# Altium schematic sheet 3V3-buck.SchDoc
size A; SheetNumber: 6; SheetTotal: 8
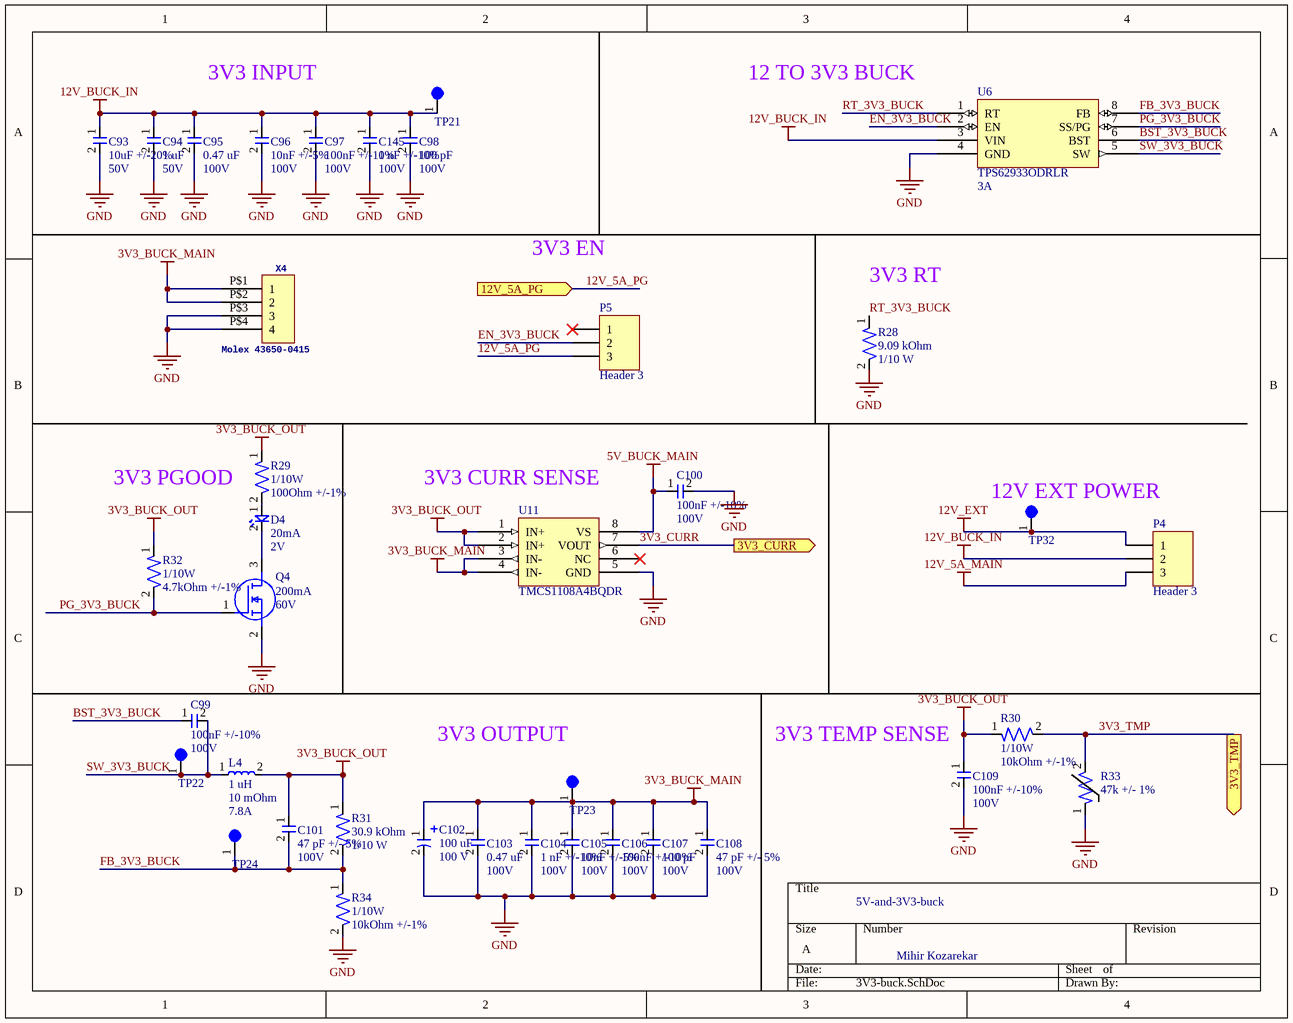
[diagram p0: 3V3-buck.SchDoc]

## Parts
C93  Capacitance: 10uF +/-20%  Voltage Rating: 50V  [CAP-1206]  (hidden comment: CL31B106KBHNNNE)
C94  Capacitance: 1 uF  Voltage: 50V  [CAP-0603]  (hidden comment: UMK107AB7105KA-T)
C95  Capacitance: 0.47 uF  Voltage: 100V  [CAP-0805]  (hidden comment: KAM21KR72A474KL)
C96  Capacitance: 10nF +/-5%  Voltage Rating: 100V  [CAP-0603]  (hidden comment: C1608C0G2A103J080AC)
C97  Capacitance: 100nF +/-10%  Voltage Rating: 100V  [CAP-0603]  (hidden comment: CC0603KRX7R0BB104)
C98  Capacitance: 100 pF  Voltage: 100V  [CAP-0603]  (hidden comment: 0603N101J101CT)
C99  Capacitance: 100nF +/-10%  Voltage Rating: 100V  [CAP-0603]  (hidden comment: CC0603KRX7R0BB104)
C100  Capacitance: 100nF +/-10%  Voltage Rating: 100V  [CAP-0603]  (hidden comment: CC0603KRX7R0BB104)
C101  Capacitance: 47 pF +/- 5%  Voltage Rating: 100V  [CAP-0603]  (hidden comment: 7447798111)
C102  Capacitance: 100 uF  Voltage: 100 V  [ELEC-100U-0001]  (hidden comment: 100SEV100M12.5X16)
C103  Capacitance: 0.47 uF  Voltage: 100V  [CAP-0805]  (hidden comment: KAM21KR72A474KL)
C104  Capacitance: 1 nF +/-10%  Voltage: 100V  [CAP-0603]  (hidden comment: C0603Y102K1RAC7867)
C105  Capacitance: 10nF +/-5%  Voltage Rating: 100V  [CAP-0603]  (hidden comment: C1608C0G2A103J080AC)
C106  Capacitance: 100nF +/-10%  Voltage Rating: 100V  [CAP-0603]  (hidden comment: CC0603KRX7R0BB104)
C107  Capacitance: 100 pF  Voltage: 100V  [CAP-0603]  (hidden comment: 0603N101J101CT)
C108  Capacitance: 47 pF +/- 5%  Voltage Rating: 100V  [CAP-0603]  (hidden comment: 7447798111)
C109  Capacitance: 100nF +/-10%  Voltage Rating: 100V  [CAP-0603]  (hidden comment: CC0603KRX7R0BB104)
C145  Capacitance: 1 nF +/-10%  Voltage: 100V  [CAP-0603]  (hidden comment: C0603Y102K1RAC7867)
D4  Current Rating: 20mA  Vf: 2V  [LED-0603]  (hidden comment: 150060AS75000)
L4  Inductance: 1 uH  DCR: 10 mOhm  DCI: 7.8A  [PWRIND-6.8U-0001]  (hidden comment: SRN8040-1R0Y)
P4  Header 3  [HDR1X3]
P5  Header 3  [HDR1X3]
Q4  Id-Continuous: 200mA  VDS-Max: 60V  [NMOS-SOT23-3]  (hidden comment: T2N7002AK,LM)
R28  Resistance: 9.09 kOhm  Power: 1/10 W  [RES-0603]  (hidden comment: RC0603FR-079K09L)
R29  Power Rating: 1/10W  Resistance: 100Ohm +/-1%  [RES-0603]  (hidden comment: AC0603FR-10100RL)
R30  Power Rating: 1/10W  Resistance: 10kOhm +/-1%  [RES-0603]  (hidden comment: RC0603FR-0710KP)
R31  Resistance: 30.9 kOhm  Power: 1/10 W  [RES-0603]  (hidden comment: RC0603FR-0730K9L)
R32  Power Rating: 1/10W  Resistance: 4.7kOhm +/-1%  [RES-0603]  (hidden comment: AF0603FR-074K7L)
R33  Resistance: 47k +/- 1%  [RES-0402]  (hidden comment: TMP6431DECR)
R34  Power Rating: 1/10W  Resistance: 10kOhm +/-1%  [RES-0603]  (hidden comment: RC0603FR-0710KP)
TP21  5003  [TEST-POINT-0001]  (value not drawn)
TP22  5003  [TEST-POINT-0001]  (value not drawn)
TP23  5003  [TEST-POINT-0001]  (value not drawn)
TP24  5003  [TEST-POINT-0001]  (value not drawn)
TP32  5003  [TEST-POINT-0001]  (value not drawn)
U6  TPS62933ODRLR  Current: 3A  [IC-SOT583]
U11  TMCS1108A4BQDR  [IC-CURRENT-0001]
X4  Molex 43650-0415  [43650-0415]

## Ports
3V3_CURR (out), 3V3_TMP (out), 12V_5A_PG (in)

## Nets
3V3_BUCK_MAIN: C102.1 C103.1 C104.1 C105.1 C106.1 C107.1 C108.1 TP23.1 U11.3(IN-) U11.4(IN-) X4.P$1(1) X4.P$2(2)
3V3_BUCK_OUT: C101.1 C109.1 L4.2 R29.1 R30.1 R31.1 R32.1 U11.1(IN+) U11.2(IN+)
5V_BUCK_MAIN: C100.1 U11.8(VS)
12V_5A_MAIN: P4.3
12V_BUCK_IN: C93.1 C94.1 C95.1 C96.1 C97.1 C98.1 C145.1 P4.2 TP21.1 U6.3(VIN)
12V_EXT: P4.1 TP32.1
GND: C93.2 C94.2 C95.2 C96.2 C97.2 C98.2 C100.2 C102.2 C103.2 C104.2 C105.2 C106.2 C107.2 C108.2 C109.2 C145.2 Q4.2(S) R28.2 R33.1 R34.2 U6.4(GND) U11.5(GND) X4.P$3(3) X4.P$4(4)
3V3_CURR: U11.7(VOUT) ; port 3V3_CURR
3V3_TMP: R30.2 R33.2 ; port 3V3_TMP
12V_5A_PG: P5.3 ; port 12V_5A_PG
BST_3V3_BUCK: C99.1 U6.6(BST)
EN_3V3_BUCK: P5.2 U6.2(EN)
FB_3V3_BUCK: C101.2 R31.2 R34.1 TP24.1 U6.8(FB)
PG_3V3_BUCK: Q4.1(G) R32.2 U6.7(SS/PG)
RT_3V3_BUCK: R28.1 U6.1(RT)
SW_3V3_BUCK: C99.2 L4.1 TP22.1 U6.5(SW)
NetD4_1: D4.1 R29.2
NetD4_2: D4.2 Q4.3(D)

Not connected (* = marked no-connect by the designer): P5 1*; U11 6(NC)*

## Notes on the sheet
- 3V3 INPUT
- 12 TO 3V3 BUCK
- 3V3 EN
- (near R28) 3V3 RT
- 3V3 PGOOD
- (near U11) 3V3 CURR SENSE
- (near TP32) 12V EXT POWER
- (near TP23) 3V3 OUTPUT
- (near C109) 3V3 TEMP SENSE
- 5V-and-3V3-buck
- Mihir Kozarekar

## Library data of the parts
C93 = CAP-10U-0001: 10 µF ±10% 50V Ceramic Capacitor X7R 1206 (3216 Metric); Manufacturer: Samsung Electro-Mechanics; Assembled?: no; Manufacturer Part Number: CL31B106KBHNNNE; Temperature Coefficient: X7R; Package Size: 1206
C94 = CAP-1U-0002: 1 µF ±10% 50V Ceramic Capacitor X7R 0603 (1608 Metric); Package Size: 0603
C95 C103 = CAP-0.47U-0001: 0.47 µF ±10% 100V Ceramic Capacitor X7R 0805 (2012 Metric); Tolerance: +/- 10%; Assembled?: No; Temperature Coefficient: X7R; Package Size: 0805
C96 C105 = CAP-10N-0002: CAP CER 10000PF 100V C0G 0603; Manufacturer: TDK Corporation; Temperature Coefficient: C0G/NP0; Assembled?: no; Manufacturer Part Number: C1608C0G2A103J080AC; Package Size: 0603
C97 C99 C100 C106 C109 = CAP-100N-0001: CAP CER 0.1UF 100V X7R 0603; Manufacturer: YAGEO; Assembled?: no; Manufacturer Part Number: CC0603KRX7R0BB104; Temperature Coefficient: X7R; Package Size: 0603
C98 C107 = CAP-100P-0002: 100 pF ±5% 100V Ceramic Capacitor C0G, NP0 0603 (1608 Metric); Tolerance: +/-5%; Temp Coeff: C0G/NP0; Package Size: 0603
C101 C108 = CAP-47P-0001: 47 pF ±5% 100V Ceramic Capacitor C0G, NP0 0603 (1608 Metric)
C102 = ELEC-100U-0001: 100 µF 100 V Aluminum Electrolytic Capacitors Radial, Can - SMD 2000 Hrs @ 85°C; Manufacturer: Rubycon; Tolerance: +/- 20%; Assembled?: No; ESR: idk check the datasheet i couldnt find it
C104 C145 = CAP-1N-0001: 1000 pF ±10% 100V Ceramic Capacitor X7R 0603 (1608 Metric)
D4 = LED_Amber_0001: CAP CER 0.1UF 100V X7R 0603; Manufacturer: Wurth Electronik; Assembled?: no; Color: Amber; Manufacturer Part Number: 150060AS75000; Package Size: 0603
L4 = PWRIND-1U-0001: 1 µH Semi-Shielded Drum Core, Wirewound Inductor 7.8 A 10mOhm Max Nonstandard; Isat: 11A; Tolerance: 30%; Assembled?: No
P4 P5 = Header 3: Header, 3-Pin; LatestRevisionDate: 17-Jul-2002; LatestRevisionNote: Re-released for DXP Platform.; Publisher: Altium Limited
Q4 = NMOS-200MA-0001: MOSFET N-CH 60V 200MA SOT23; Manufacturer: Toshiba; FET type: N-Channel; Rds On-Max: 3.9Ohm; Vgs-Max: 20V; Assembled?: no; Manufacturer Part Number: T2N7002AK,LM; Package: SOT-23-3
R28 = RES-9.09K-0001: 9.09 kOhms ±1% 0.1W, 1/10W Chip Resistor 0603 (1608 Metric) Moisture Resistant Thick Film; Tolerance: +/-1%; Assembled?: No; Package Size: 0603
R29 = RES-100-0002: 100 Ohms ±1% 0.1W, 1/10W Chip Resistor 0603 (1608 Metric) Automotive AEC-Q200 Thick Film; Manufacturer: YAGEO; Assembled?: no; Manufacturer Part Number: AC0603FR-10100RL; Package Size: 0603
R30 R34 = RES-10K-0002: RES SMD 10K OHM 1% 1/10W 0603; Manufacturer: YAGEO; Assembled?: no; Manufacturer Part Number: RC0603FR-0710KP; Package Size: 0603
R31 = RES-30.9K-0001: 30.9 kOhms ±1% 0.1W, 1/10W Chip Resistor 0603 (1608 Metric) Moisture Resistant Thick Film; Assembled?: No; Tolerance: 1%; Package Size: 0603
R32 = RES-4.7K-0002: RES SMD 4.7K OHM 1% 1/10W 0603; Manufacturer: YAGEO; Assembled?: no; Manufacturer Part Number: AF0603FR-074K7L; Package Size: 0603
R33 = THERM-47K-0001: PTC Thermistor 47 kOhms 0402 (1006 Metric); Manufacturer: Texas Instruments; Manufacturer Part Number: TMP6431DECR; Package Size: 0402
TP21-TP24 TP32 = TEST-POINT-0001: Oranange PC Test Point, Miniature Phoisphor Bronze Silver Plating Through Hole Mounting Type
U6 = IC-BUCK-0010: Buck Switching Regulator IC Positive Adjustable 0.8V 1 Output 3A SOT-583; Manufacturer: Texas Instruments; Assembled?: no; Manufacturer Part Number: TPS62933ODRLR; Type: Buck
U11 = IC-CURRENT-0004: Current Sensor 1 Channel Hall Effect Bidirectional 8-SOIC (0.154", 3.90mm Width); Assembled?: No; Supply Voltage: 5V; Footprint: 8-SOIC
X4 = Micro-Fit Molex 4 Pin Vertical: GateName_1: G$1; SymbolName_1: HEADER_POS4; DeviceSetName: HEADER_POS4_?; DeviceName: 43650-0415; LibraryName: con-molex-micro-fit-3_0_2; Package: 43650-0415